# EAGLE design rc2014_6522 (EAGLE 8.1.1)
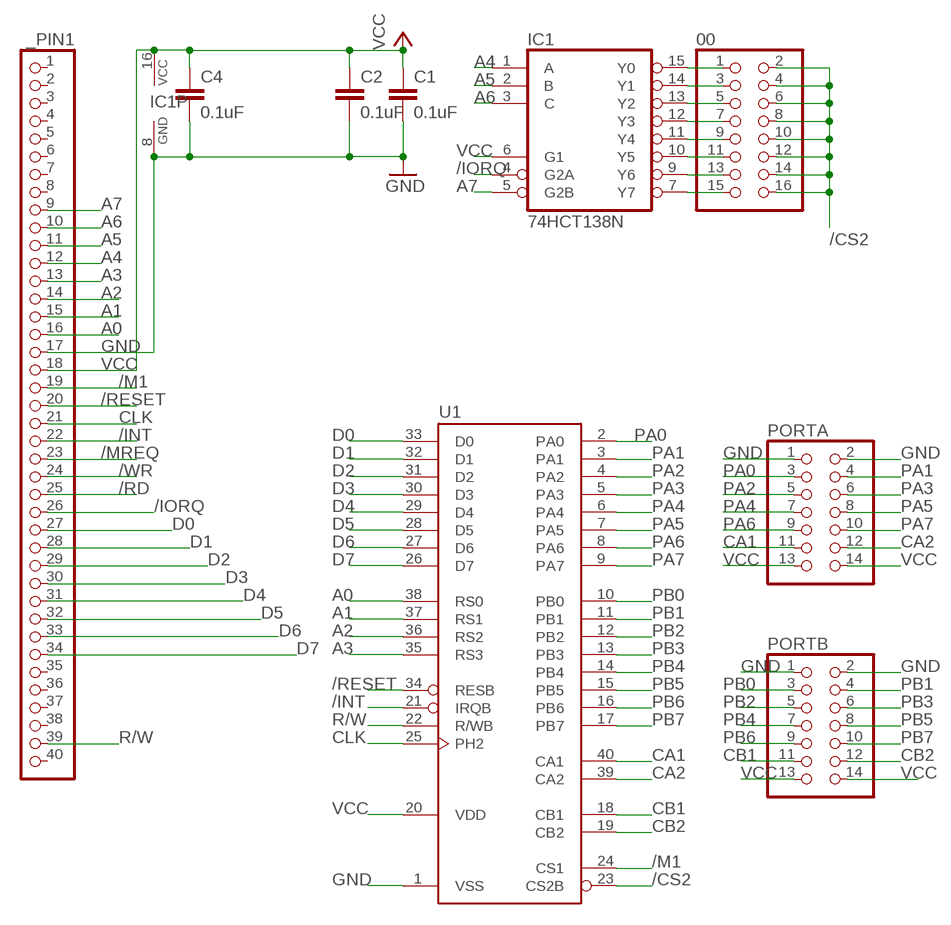
[diagram p0: schematic, sheet 1]

## Parts
00  PINHD-2X8  [2X08]
_PIN1  PINHD-1X40  [1X40]
C1  0.1uF  C-EU050-024X044  [C050-024X044]
C2  0.1uF  C-EU050-024X044  [C050-024X044]
C4  0.1uF  C-EU050-024X044  [C050-024X044]
IC1  74HCT138N  [DIL16]
PORTA  PINHD-2X7  [2X07]
PORTB  PINHD-2X7  [2X07]
U1  G65SC22P  [DIP-40]

## Nets
/CS2: 00.2 00.4 00.6 00.8 00.10 00.12 00.14 00.16 U1.23(CS2B)
/INT: _PIN1.22 U1.21(IRQB)
/IORQ: _PIN1.26 IC1.4(G2A)
/M1: _PIN1.19 U1.24(CS1)
/MREQ: _PIN1.23
/RD: _PIN1.25
/RESET: _PIN1.20 U1.34(RESB)
/WR: _PIN1.24
A0: _PIN1.16 U1.38(RS0)
A1: _PIN1.15 U1.37(RS1)
A2: _PIN1.14 U1.36(RS2)
A3: _PIN1.13 U1.35(RS3)
A4: _PIN1.12 IC1.1(A)
A5: _PIN1.11 IC1.2(B)
A6: _PIN1.10 IC1.3(C)
A7: _PIN1.9 IC1.5(G2B)
CA1: PORTA.11 U1.40(CA1)
CA2: PORTA.12 U1.39(CA2)
CB1: PORTB.11 U1.18(CB1)
CB2: PORTB.12 U1.19(CB2)
CLK: _PIN1.21 U1.25(PH2)
D0: _PIN1.27 U1.33(D0)
D1: _PIN1.28 U1.32(D1)
D2: _PIN1.29 U1.31(D2)
D3: _PIN1.30 U1.30(D3)
D4: _PIN1.31 U1.29(D4)
D5: _PIN1.32 U1.28(D5)
D6: _PIN1.33 U1.27(D6)
D7: _PIN1.34 U1.26(D7)
GND: _PIN1.17 C1.2 C2.2 C4.2 IC1.8(GND) PORTA.1 PORTA.2 PORTB.1 PORTB.2 U1.1(VSS)
N$6: 00.1 IC1.15(Y0)
N$7: 00.3 IC1.14(Y1)
N$8: 00.5 IC1.13(Y2)
N$9: 00.7 IC1.12(Y3)
N$10: 00.9 IC1.11(Y4)
N$11: 00.11 IC1.10(Y5)
N$12: 00.13 IC1.9(Y6)
N$13: 00.15 IC1.7(Y7)
PA0: PORTA.3 U1.2(PA0)
PA1: PORTA.4 U1.3(PA1)
PA2: PORTA.5 U1.4(PA2)
PA3: PORTA.6 U1.5(PA3)
PA4: PORTA.7 U1.6(PA4)
PA5: PORTA.8 U1.7(PA5)
PA6: PORTA.9 U1.8(PA6)
PA7: PORTA.10 U1.9(PA7)
PB0: PORTB.3 U1.10(PB0)
PB1: PORTB.4 U1.11(PB1)
PB2: PORTB.5 U1.12(PB2)
PB3: PORTB.6 U1.13(PB3)
PB4: PORTB.7 U1.14(PB4)
PB5: PORTB.8 U1.15(PB5)
PB6: PORTB.9 U1.16(PB6)
PB7: PORTB.10 U1.17(PB7)
R/W: _PIN1.39 U1.22(R/WB)
VCC: _PIN1.18 C1.1 C2.1 C4.1 IC1.6(G1) IC1.16(VCC) PORTA.13 PORTA.14 PORTB.13 PORTB.14 U1.20(VDD)
Unconnected: _PIN1.1 _PIN1.2 _PIN1.3 _PIN1.4 _PIN1.5 _PIN1.6 _PIN1.7 _PIN1.8 _PIN1.35 _PIN1.36 _PIN1.37 _PIN1.38 _PIN1.40

## Library data of the parts
00 = pinhead:PINHD-2X8: PIN HEADER
_PIN1 = pinhead:PINHD-1X40: PIN HEADER
C1 C2 C4 = rcl:C-EU: CAPACITOR, European symbol
IC1 = 74xx-eu:74*138: 3-line to 8-line DECODER/DEMULTIPLEXER
PORTA PORTB = pinhead:PINHD-2X7: PIN HEADER
U1 = 65xxx:G65SC22P: California Micro Devices Version

## Net classes
0 +5V: width 0.508 mm

## Board
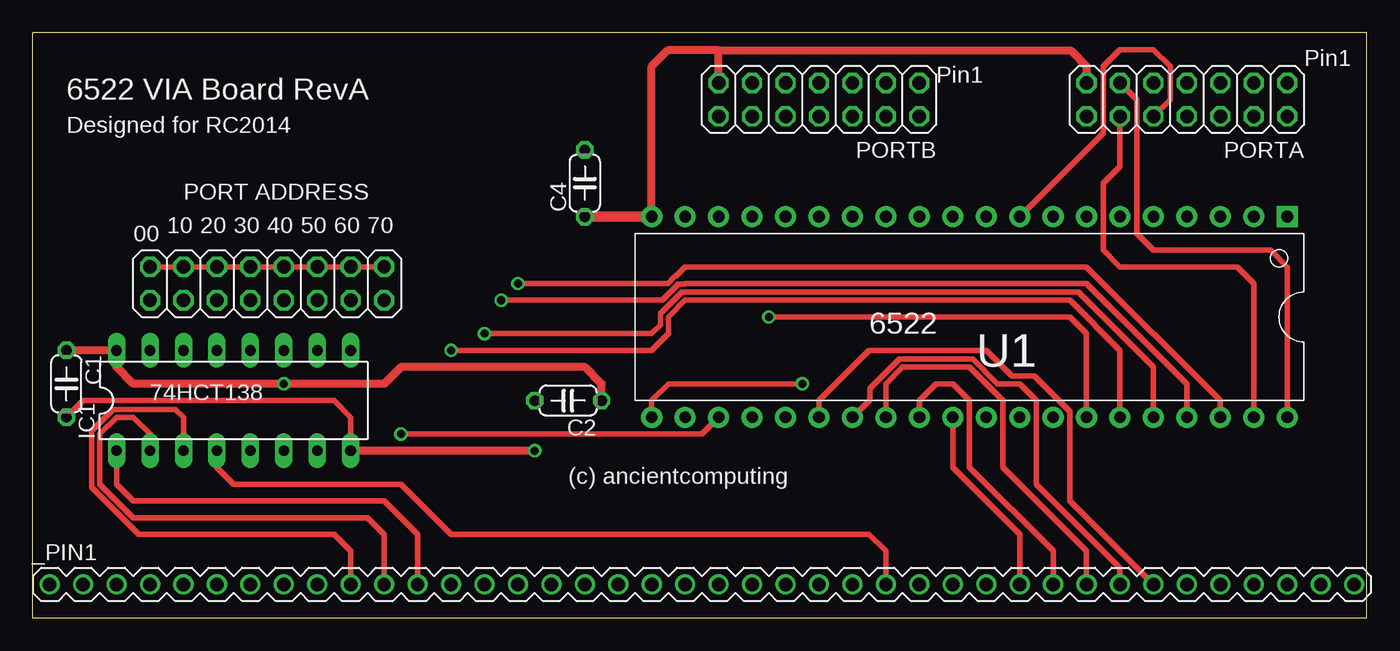
[diagram p1: board, top side]
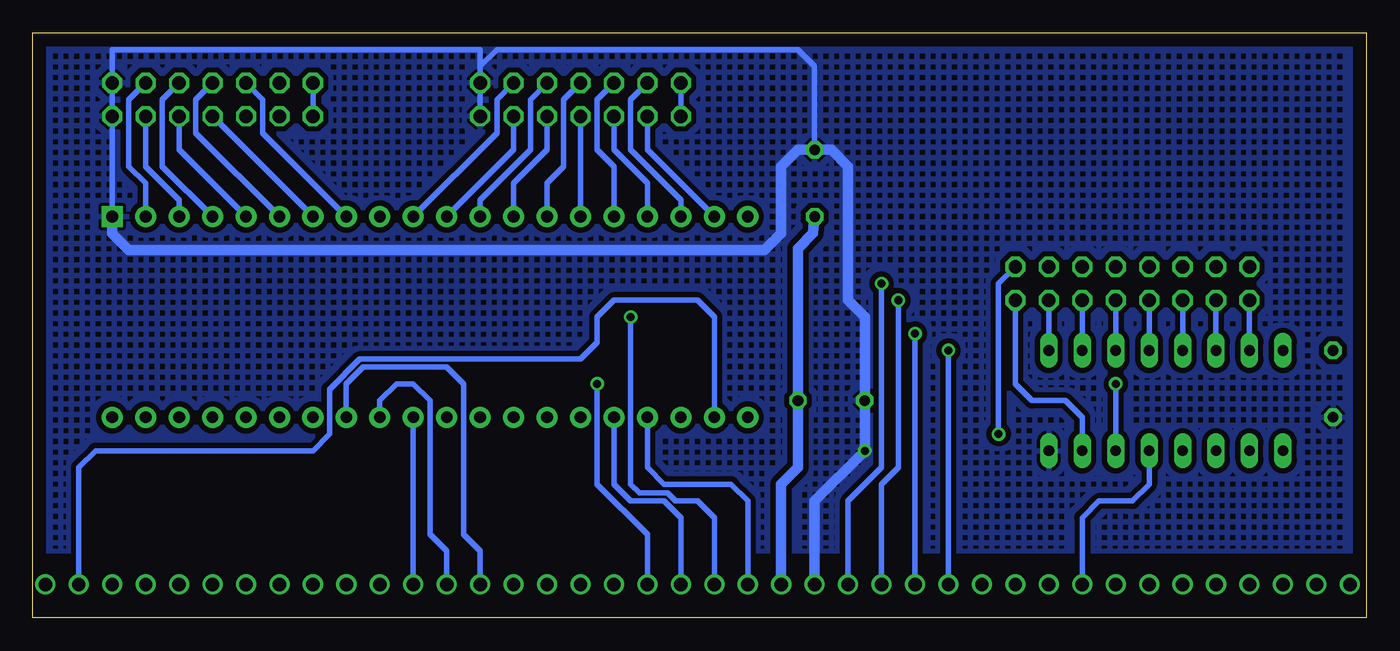
[diagram p2: board, bottom side, seen from below]

Size 101.27 x 44.44 mm. Coordinates in mm from the lower left corner, seen from the top.
Outline: 0,0 101.27,0 101.27,44.44 0,44.44 0,0
Copper layers (1*16): Top 0.035mm / dielectric 1.5mm / Bottom 0.035mm
Design rules "default *": minimum track width 20mil, minimum drill 24mil, track to track 8mil, track to pad 8mil, pad to pad 8mil, via to via 8mil, smd to smd 8mil, copper to edge 40mil, drill to drill 8mil, minimum pad ring 10mil, minimum via ring 8mil, stop-mask expansion 4mil, vias tented up to drill 0mil, thermal gap 10mil

### Footprints (pad centres in the part's own frame; a part is rotated, then mirrored left to right if it is on the bottom)
2X08 = drill 1.016 octagon: 1 -8.89,-1.27; 2 -8.89,1.27; 3 -6.35,-1.27; 4 -6.35,1.27; 5 -3.81,-1.27; 6 -3.81,1.27; 7 -1.27,-1.27; 8 -1.27,1.27; 9 1.27,-1.27; 10 1.27,1.27; 11 3.81,-1.27; 12 3.81,1.27; 13 6.35,-1.27; 14 6.35,1.27; 15 8.89,-1.27; 16 8.89,1.27
1X40 = drill 1.016: 1 -49.53,0; 2 -46.99,0; 3 -44.45,0; 4 -41.91,0; 5 -39.37,0; 6 -36.83,0; 7 -34.29,0; 8 -31.75,0; 9 -29.21,0; 10 -26.67,0; 11 -24.13,0; 12 -21.59,0; 13 -19.05,0; 14 -16.51,0; 15 -13.97,0; 16 -11.43,0; 17 -8.89,0; 18 -6.35,0; 19 -3.81,0; 20 -1.27,0; 21 1.27,0; 22 3.81,0; 23 6.35,0; 24 8.89,0; 25 11.43,0; 26 13.97,0; 27 16.51,0; 28 19.05,0; 29 21.59,0; 30 24.13,0; 31 26.67,0; 32 29.21,0; 33 31.75,0; 34 34.29,0; 35 36.83,0; 36 39.37,0; 37 41.91,0; 38 44.45,0; 39 46.99,0; 40 49.53,0
C050-024X044 = drill 0.813 octagon: 1 -2.54,0; 2 2.54,0
DIL16 = drill 0.813 long: 1 -8.89,-3.81; 2 -6.35,-3.81; 3 -3.81,-3.81; 4 -1.27,-3.81; 5 1.27,-3.81; 6 3.81,-3.81; 7 6.35,-3.81; 8 8.89,-3.81; 9 8.89,3.81; 10 6.35,3.81; 11 3.81,3.81; 12 1.27,3.81; 13 -1.27,3.81; 14 -3.81,3.81; 15 -6.35,3.81; 16 -8.89,3.81
2X07 = drill 1.016 octagon: 1 -7.62,-1.27; 2 -7.62,1.27; 3 -5.08,-1.27; 4 -5.08,1.27; 5 -2.54,-1.27; 6 -2.54,1.27; 7 0,-1.27; 8 0,1.27; 9 2.54,-1.27; 10 2.54,1.27; 11 5.08,-1.27; 12 5.08,1.27; 13 7.62,-1.27; 14 7.62,1.27
DIP-40 = drill 0.889 pad 1.6 square: 1 -22.86,-7.62 | drill 0.889 pad 1.6: 2 -20.32,-7.62; 3 -17.78,-7.62; 4 -15.24,-7.62; 5 -12.7,-7.62; 6 -10.16,-7.62; 7 -7.62,-7.62; 8 -5.08,-7.62; 9 -2.54,-7.62; 10 0,-7.62; 11 2.54,-7.62; 12 5.08,-7.62; 13 7.62,-7.62; 14 10.16,-7.62; 15 12.7,-7.62; 16 15.24,-7.62; 17 17.78,-7.62; 18 20.32,-7.62; 19 22.86,-7.62; 20 25.4,-7.62; 21 25.4,7.62; 22 22.86,7.62; 23 20.32,7.62; 24 17.78,7.62; 25 15.24,7.62; 26 12.7,7.62; 27 10.16,7.62; 28 7.62,7.62; 29 5.08,7.62; 30 2.54,7.62; 31 0,7.62; 32 -2.54,7.62; 33 -5.08,7.62; 34 -7.62,7.62; 35 -10.16,7.62; 36 -12.7,7.62; 37 -15.24,7.62; 38 -17.78,7.62; 39 -20.32,7.62; 40 -22.86,7.62

### Placement (x,y rotation side)
00  17.78,25.4 0 top
_PIN1  50.8,2.54 0 top
C1  2.54,17.78 270 top
C2  40.64,16.51 180 top
C4  41.91,33.02 90 top
IC1  15.24,16.51 0 top
PORTA  87.63,39.37 180 top
PORTB  59.69,39.37 180 top
U1  72.39,22.86 180 top

### Tracks (layer width: path | path; a pad name or v marks a point on that pad's centre or on a via)
/CS2  (via drill 0.61)
  Top 0.406: U1.23 50.8,13.97 v27.94,13.97 | 00.2 00.4 00.6 00.8 00.10 00.12 00.14 00.16
  Bottom 0.406: 00.16 27.94,25.4 v27.94,13.97
/INT  (via drill 0.61)
  Top 0.406: U1.21 46.99,16.51 48.26,17.78 v58.42,17.78
  Bottom 0.406: _PIN1.22 54.61,6.35 58.42,10.16 v58.42,17.78
/IORQ
  Top 0.406: IC1.4 13.97,11.43 15.24,10.16 27.94,10.16 31.75,6.35 63.5,6.35 64.77,5.08 _PIN1.26
/M1
  Bottom 0.406: _PIN1.19 46.99,8.89 48.26,10.16 53.34,10.16 54.61,11.43 U1.24
/RESET  (via drill 0.61)
  Top 0.406: v55.88,22.86 78.74,22.86 80.01,21.59 U1.34
  Bottom 0.406: _PIN1.20 49.53,7.62 50.8,8.89 52.48,8.89 53.09,9.5 55.22,9.5 55.88,10.16 v55.88,22.86
A0  (via drill 0.61)
  Top 0.406: v36.83,25.4 48.21,25.4 48.77,25.96 48.82,25.96 49.53,26.67 80.01,26.67 90.17,16.51 U1.38
  Bottom 0.406: _PIN1.16 39.37,8.89 36.83,11.43 v36.83,25.4
A1  (via drill 0.61)
  Top 0.406: v35.56,24.13 47.81,24.13 49.02,25.35 49.48,25.35 49.53,25.4 80.01,25.4 87.63,17.78 U1.37
  Bottom 0.406: _PIN1.15 36.83,10.16 35.56,11.43 v35.56,24.13
A2  (via drill 0.61)
  Top 0.406: v34.29,21.59 46.99,21.59 47.65,22.25 47.65,23.11 49.28,24.74 79.4,24.74 85.09,19.05 U1.36
  Bottom 0.406: _PIN1.14 v34.29,21.59
A3  (via drill 0.61)
  Top 0.406: U1.35 82.55,20.32 78.74,24.13 49.53,24.13 48.26,22.86 48.26,21.59 46.99,20.32 v31.75,20.32
  Bottom 0.406: _PIN1.13 v31.75,20.32
A4
  Top 0.406: _PIN1.12 29.21,6.35 26.67,8.89 7.62,8.89 6.35,10.16 IC1.1
A5
  Top 0.406: _PIN1.11 26.67,6.35 25.4,7.62 7.62,7.62 5.08,10.16 5.08,13.97 6.35,15.24 7.62,15.24 8.89,13.97 IC1.2
A6
  Top 0.406: _PIN1.10 24.13,5.08 22.86,6.35 8.03,6.35 4.47,9.91 4.47,14.22 6.1,15.85 10.82,15.85 11.43,15.24 IC1.3
A7
  Bottom 0.406: IC1.5 16.51,10.16 17.78,8.89 20.32,8.89 21.59,7.62 _PIN1.9
CA1
  Top 0.406: PORTA.11 83.82,39.37 83.82,29.21 85.09,27.94 93.98,27.94 95.25,26.67 U1.40
CA2
  Top 0.406: PORTA.12 82.55,34.29 81.28,33.02 81.28,27.94 82.55,26.67 91.44,26.67 92.71,25.4 U1.39
CB1
  Bottom 0.406: U1.18 52.07,31.75 55.88,35.56 55.88,39.37 PORTB.11
CB2
  Bottom 0.406: U1.19 54.61,35.56 PORTB.12
CLK
  Bottom 0.406: _PIN1.21 52.07,7.62 53.34,8.89 55.88,8.89 57.15,10.16 U1.25
D0
  Bottom 0.406: _PIN1.27 67.31,5.08 68.58,6.35 68.58,17.78 69.85,19.05 76.2,19.05 77.47,17.78 U1.33
D1
  Bottom 0.406: _PIN1.28 69.85,5.08 71.12,6.35 71.12,16.51 72.39,17.78 73.66,17.78 74.93,16.51 U1.32
D2
  Bottom 0.406: _PIN1.29 U1.31
D3
  Top 0.406: U1.30 69.85,11.43 74.93,6.35 _PIN1.30
D4
  Top 0.406: _PIN1.31 77.47,5.08 71.12,11.43 71.12,16.51 69.85,17.78 68.58,17.78 67.31,16.51 U1.29
D5
  Top 0.406: _PIN1.32 80.01,5.08 73.66,11.43 73.66,16.51 71.12,19.05 66.04,19.05 64.77,17.78 U1.28
D6
  Top 0.406: _PIN1.33 82.55,3.81 76.2,10.16 76.2,16.51 74.93,17.78 73.25,17.78 71.37,19.66 65.79,19.66 63.56,17.44 63.56,16.57 U1.27
D7
  Top 0.406: _PIN1.34 78.74,8.89 78.74,15.68 76.03,18.39 74.32,18.39 72.39,20.32 63.5,20.32 59.69,16.51 U1.26
GND  (via drill 0.61)
  Top 0.406: IC1.8 24.13,15.24 22.86,16.51 3.81,16.51 C1.2
  Top 0.61: v38.1,12.7 IC1.8
  Bottom 0.406: PORTB.2 PORTB.1 67.31,41.91 | 67.31,41.91 66.04,43.18 43.18,43.18 41.91,41.91 C4.2 | 67.31,41.91 67.31,43.18 95.25,43.18 PORTA.1 PORTA.2 U1.1
  Bottom 0.813: _PIN1.17 41.91,8.89 v38.1,12.7 C2.2 38.1,22.86 39.37,24.13 39.37,34.29 40.64,35.56 C4.2 43.18,35.56 44.45,34.29 44.45,29.21 45.72,27.94 93.98,27.94 95.25,29.21 U1.1
  pour Bottom (isolate 0.406, hatched): 0,44.45 0,5.08 101.6,5.08 101.6,44.45
N$6
  Bottom 0.406: 00.1 IC1.15
N$7
  Bottom 0.406: 00.3 IC1.14
N$8
  Bottom 0.406: 00.5 IC1.13
N$9
  Bottom 0.406: 00.7 IC1.12
N$10
  Bottom 0.406: 00.9 IC1.11
N$11
  Bottom 0.406: 00.11 IC1.10
N$12
  Bottom 0.406: 00.13 IC1.9
N$13
  Bottom 0.406: IC1.7 21.59,15.24 22.86,16.51 25.4,16.51 26.67,17.78 00.15
PA0
  Bottom 0.406: U1.2 92.71,33.02 93.98,34.29 93.98,39.37 PORTA.3
PA1
  Bottom 0.406: PORTA.4 92.71,34.29 90.17,31.75 U1.3
PA2
  Bottom 0.406: U1.4 91.44,34.29 91.44,39.37 PORTA.5
PA3
  Bottom 0.406: U1.5 90.17,35.56 PORTA.6
PA4
  Bottom 0.406: U1.6 88.9,36.83 88.9,39.37 PORTA.7
PA5
  Bottom 0.406: U1.7 PORTA.8
PA6
  Bottom 0.406: U1.8 83.82,36.83 83.82,39.37 PORTA.9
PA7
  Top 0.406: U1.9 81.28,36.83 81.28,41.91 82.55,43.18 85.09,43.18 86.36,41.91 86.36,39.37 PORTA.10
PB0
  Bottom 0.406: PORTB.3 66.04,39.37 66.04,36.83 U1.10
PB1
  Bottom 0.406: U1.11 64.77,35.56 PORTB.4
PB2
  Bottom 0.406: U1.12 67.31,31.75 63.5,35.56 63.5,39.37 PORTB.5
PB3
  Bottom 0.406: U1.13 64.77,33.02 62.23,35.56 PORTB.6
PB4
  Bottom 0.406: U1.14 62.23,33.02 60.96,34.29 60.96,39.37 PORTB.7
PB5
  Bottom 0.406: U1.15 PORTB.8
PB6
  Bottom 0.406: U1.16 57.15,34.29 58.42,35.56 58.42,39.37 PORTB.9
PB7
  Bottom 0.406: U1.17 54.61,33.02 57.15,35.56 PORTB.10
R/W
  Bottom 0.406: _PIN1.39 97.79,11.43 96.52,12.7 80.01,12.7 78.74,13.97 78.74,17.37 76.45,19.66 59.69,19.66 58.42,20.93 58.42,22.86 57.15,24.13 50.8,24.13 49.53,22.86 U1.22
VCC  (via drill 0.61)
  Top 0.61: C1.1 IC1.16 6.35,19.05 7.62,17.78 v19.05,17.78 26.67,17.78 27.94,19.05 41.91,19.05 43.18,17.78 C2.1 | U1.20 46.99,41.91 48.2,43.12 52.07,43.12 | 52.07,43.12 78.8,43.12 80.01,41.91 PORTA.13 | PORTB.13 52.07,43.12
  Top 0.813: C4.1 U1.20
  Bottom 0.406: PORTA.13 PORTA.14 | PORTB.13 PORTB.14 | IC1.6 v19.05,17.78
  Bottom 0.813: _PIN1.18 44.45,10.16 43.18,11.43 C2.1 43.18,28.07 42.02,29.22 C4.1

### Text on the board
tNames: Pin1 | Pin1 | 6522 VIA Board RevA | Designed for RC2014 | PORT ADDRESS | 10 | 20 | 30 | 40 | 50 | 60 | 70 | 6522 | 74HCT138 | (c) ancientcomputing